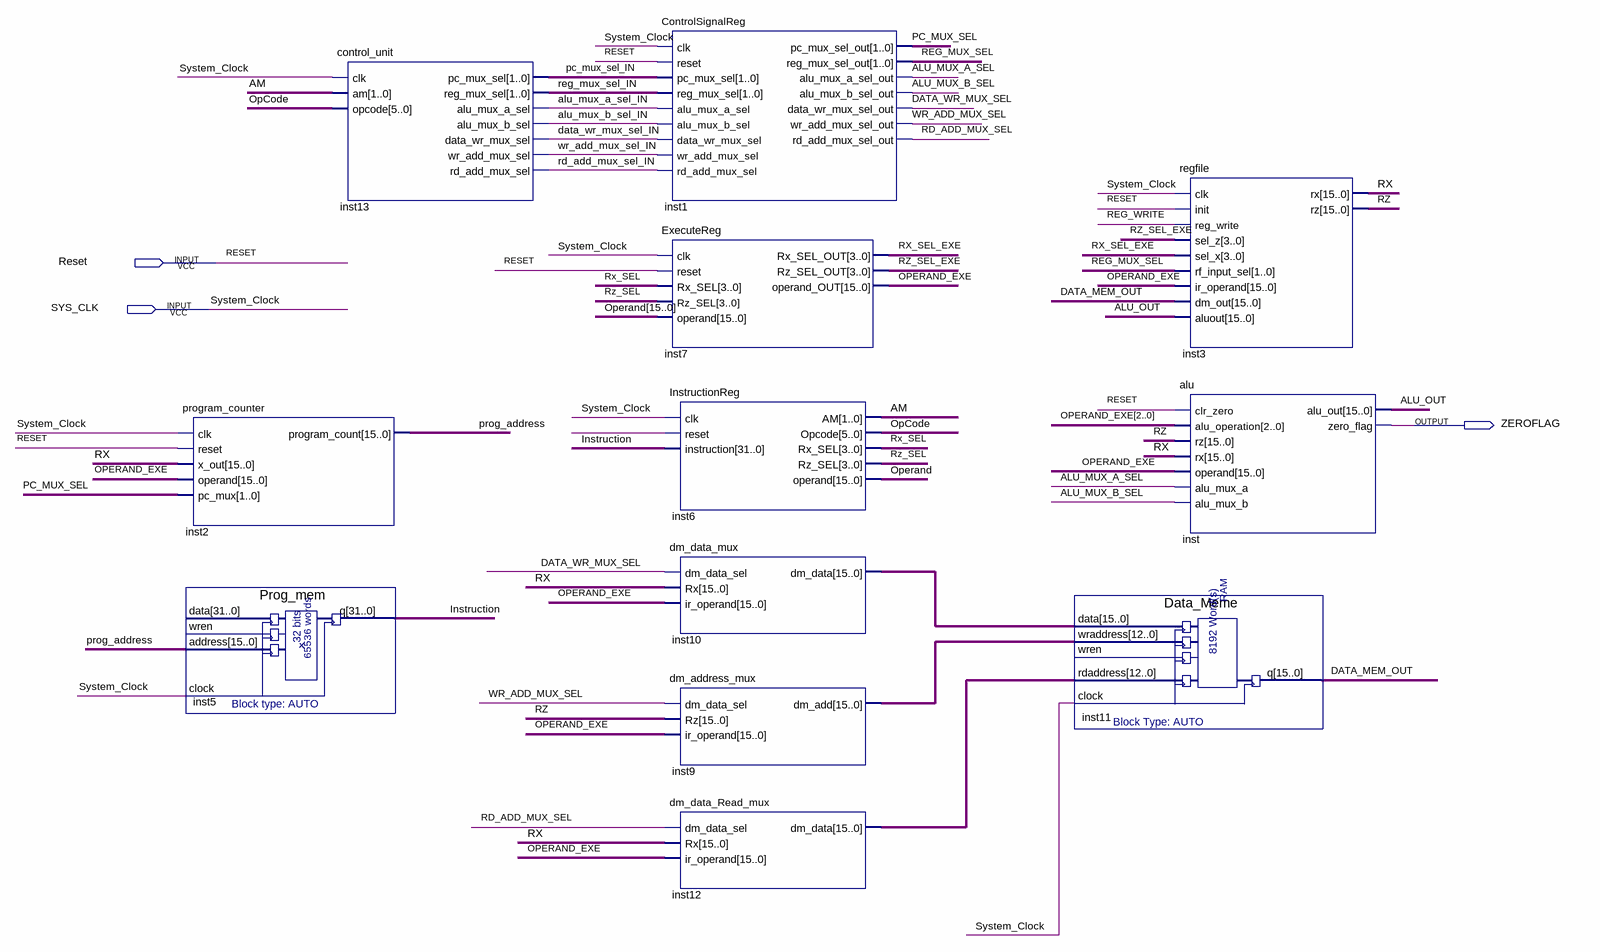
[diagram p0: schematic sheet]
// Quartus schematic RecopPiped.bdf as structural Verilog: 12 symbols, 3 pins
module RecopPiped (
  input  Reset,
  input  SYS_CLK,
  output ZEROFLAG
);

  wire ALU_MUX_A_SEL, alu_mux_a_sel_IN, ALU_MUX_B_SEL, alu_mux_b_sel_IN, ALU_OUT, AM, DATA_MEM_OUT,
       DATA_WR_MUX_SEL, data_wr_mux_sel_IN, Instruction, OpCode, Operand_1bit, OPERAND_EXE_1bit, PC_MUX_SEL,
       pc_mux_sel_IN, prog_address, RD_ADD_MUX_SEL, rd_add_mux_sel_IN, REG_MUX_SEL, reg_mux_sel_IN,
       REG_WRITE, RX, Rx_SEL, RX_SEL_EXE, RZ, Rz_SEL, RZ_SEL_EXE, undriven, WR_ADD_MUX_SEL, wr_add_mux_sel_IN;
  wire [2:0] OPERAND_EXE;
  wire [15:0] inst9_dm_add, inst10_dm_data, inst12_dm_data, Operand;

  program_counter inst2 (
    .clk(SYS_CLK), .reset(Reset), .x_out({16{RX}}), .operand({16{OPERAND_EXE_1bit}}),
    .pc_mux({2{PC_MUX_SEL}}), .program_count(prog_address));
  Prog_mem inst5 (.address({16{prog_address}}), .clock(SYS_CLK), .q(Instruction));  // open: data, wren
  control_unit inst13 (
    .clk(SYS_CLK), .am({2{AM}}), .opcode({6{OpCode}}), .pc_mux_sel(pc_mux_sel_IN),
    .reg_mux_sel(reg_mux_sel_IN), .alu_mux_a_sel(alu_mux_a_sel_IN), .alu_mux_b_sel(alu_mux_b_sel_IN),
    .data_wr_mux_sel(data_wr_mux_sel_IN), .wr_add_mux_sel(wr_add_mux_sel_IN),
    .rd_add_mux_sel(rd_add_mux_sel_IN));
  ControlSignalReg inst1 (
    .clk(SYS_CLK), .reset(Reset), .pc_mux_sel({2{pc_mux_sel_IN}}), .reg_mux_sel({2{reg_mux_sel_IN}}),
    .alu_mux_a_sel(alu_mux_a_sel_IN), .alu_mux_b_sel(alu_mux_b_sel_IN), .data_wr_mux_sel(data_wr_mux_sel_IN),
    .wr_add_mux_sel(wr_add_mux_sel_IN), .rd_add_mux_sel(rd_add_mux_sel_IN), .pc_mux_sel_out(PC_MUX_SEL),
    .reg_mux_sel_out(REG_MUX_SEL), .alu_mux_a_sel_out(ALU_MUX_A_SEL), .alu_mux_b_sel_out(ALU_MUX_B_SEL),
    .data_wr_mux_sel_out(DATA_WR_MUX_SEL), .wr_add_mux_sel_out(WR_ADD_MUX_SEL),
    .rd_add_mux_sel_out(RD_ADD_MUX_SEL));
  ExecuteReg inst7 (
    .clk(SYS_CLK), .reset(Reset), .Rx_SEL({4{Rx_SEL}}), .Rz_SEL({4{Rz_SEL}}), .operand(Operand),
    .Rx_SEL_OUT(RX_SEL_EXE), .Rz_SEL_OUT(RZ_SEL_EXE), .operand_OUT(OPERAND_EXE_1bit));
  InstructionReg inst6 (
    .clk(SYS_CLK), .reset(undriven), .instruction({32{Instruction}}), .AM(AM), .Opcode(OpCode),
    .Rx_SEL(Rx_SEL), .Rz_SEL(Rz_SEL), .operand(Operand_1bit));
  dm_data_mux inst10 (
    .dm_data_sel(DATA_WR_MUX_SEL), .Rx({16{RX}}), .ir_operand({16{OPERAND_EXE_1bit}}),
    .dm_data(inst10_dm_data));
  dm_address_mux inst9 (
    .dm_data_sel(WR_ADD_MUX_SEL), .Rz({16{RZ}}), .ir_operand({16{OPERAND_EXE_1bit}}), .dm_add(inst9_dm_add));
  dm_data_Read_mux inst12 (
    .dm_data_sel(RD_ADD_MUX_SEL), .Rx({16{RX}}), .ir_operand({16{OPERAND_EXE_1bit}}), .dm_data(inst12_dm_data));
  Data_Meme inst11 (
    .data(inst10_dm_data), .wraddress(inst9_dm_add), .rdaddress(inst12_dm_data), .clock(SYS_CLK),
    .q(DATA_MEM_OUT));  // open: wren
  regfile inst3 (
    .clk(SYS_CLK), .init(Reset), .reg_write(REG_WRITE), .sel_z({4{RZ_SEL_EXE}}), .sel_x({4{RX_SEL_EXE}}),
    .rf_input_sel({2{REG_MUX_SEL}}), .ir_operand({16{OPERAND_EXE_1bit}}), .dm_out({16{DATA_MEM_OUT}}),
    .aluout({16{ALU_OUT}}), .rx(RX), .rz(RZ));
  alu inst (
    .clr_zero(Reset), .alu_operation(OPERAND_EXE), .rz({16{RZ}}), .rx({16{RX}}),
    .operand({16{OPERAND_EXE_1bit}}), .alu_mux_a(ALU_MUX_A_SEL), .alu_mux_b(ALU_MUX_B_SEL),
    .alu_out(ALU_OUT), .zero_flag(ZEROFLAG));

  // Other names for the same wires on the sheet: System_Clock = SYS_CLK
endmodule
